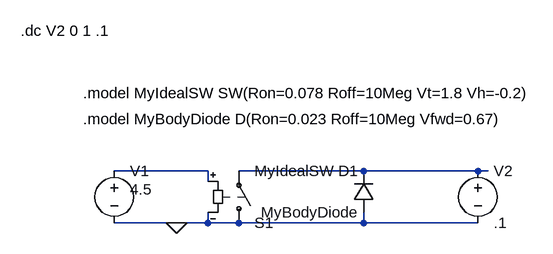
[diagram p0: schematic Q3_2_4.asc]
Q3_2_4.asc, the LTspice schematic file:
Version 4.1
SHEET 1 880 680
WIRE 176 128 32 128
WIRE 416 128 224 128
WIRE 592 128 416 128
WIRE 608 128 592 128
WIRE 176 144 176 128
WIRE 128 208 32 208
WIRE 176 208 176 192
WIRE 176 208 128 208
WIRE 224 208 176 208
WIRE 416 208 416 192
WIRE 416 208 224 208
WIRE 592 208 416 208
FLAG 128 208 0
SYMBOL voltage 32 112 R0
WINDOW 123 0 0 Left 0
WINDOW 39 0 0 Left 0
WINDOW 3 24 44 Left 2
SYMATTR Value 4.5
SYMATTR InstName V1
SYMBOL sw 224 224 M180
SYMATTR InstName S1
SYMATTR Value MyIdealSW
SYMBOL diode 432 192 R180
WINDOW 0 24 64 Left 2
WINDOW 3 24 0 Left 2
SYMATTR InstName D1
SYMATTR Value MyBodyDiode
SYMBOL voltage 592 112 R0
WINDOW 123 0 0 Left 0
WINDOW 39 0 0 Left 0
SYMATTR InstName V2
SYMATTR Value .1
TEXT -16 8 Left 2 !.model MyIdealSW SW(Ron=0.078 Roff=10Meg Vt=1.8 Vh=-0.2)
TEXT -16 48 Left 2 !.model MyBodyDiode D(Ron=0.023 Roff=10Meg Vfwd=0.67)
TEXT -112 -88 Left 2 !.dc V2 0 1 .1

The netlist it stands for:
* Q3_2_4.asc
V1 N001 0 4.5
S1 0 N002 N001 0 MyIdealSW
D1 0 N002 MyBodyDiode
V2 N002 0 .1
.model D D
.lib standard.dio
.model MyIdealSW SW(Ron=0.078 Roff=10Meg Vt=1.8 Vh=-0.2)
.model MyBodyDiode D(Ron=0.023 Roff=10Meg Vfwd=0.67)
.dc V2 0 1 .1
.backanno
.end